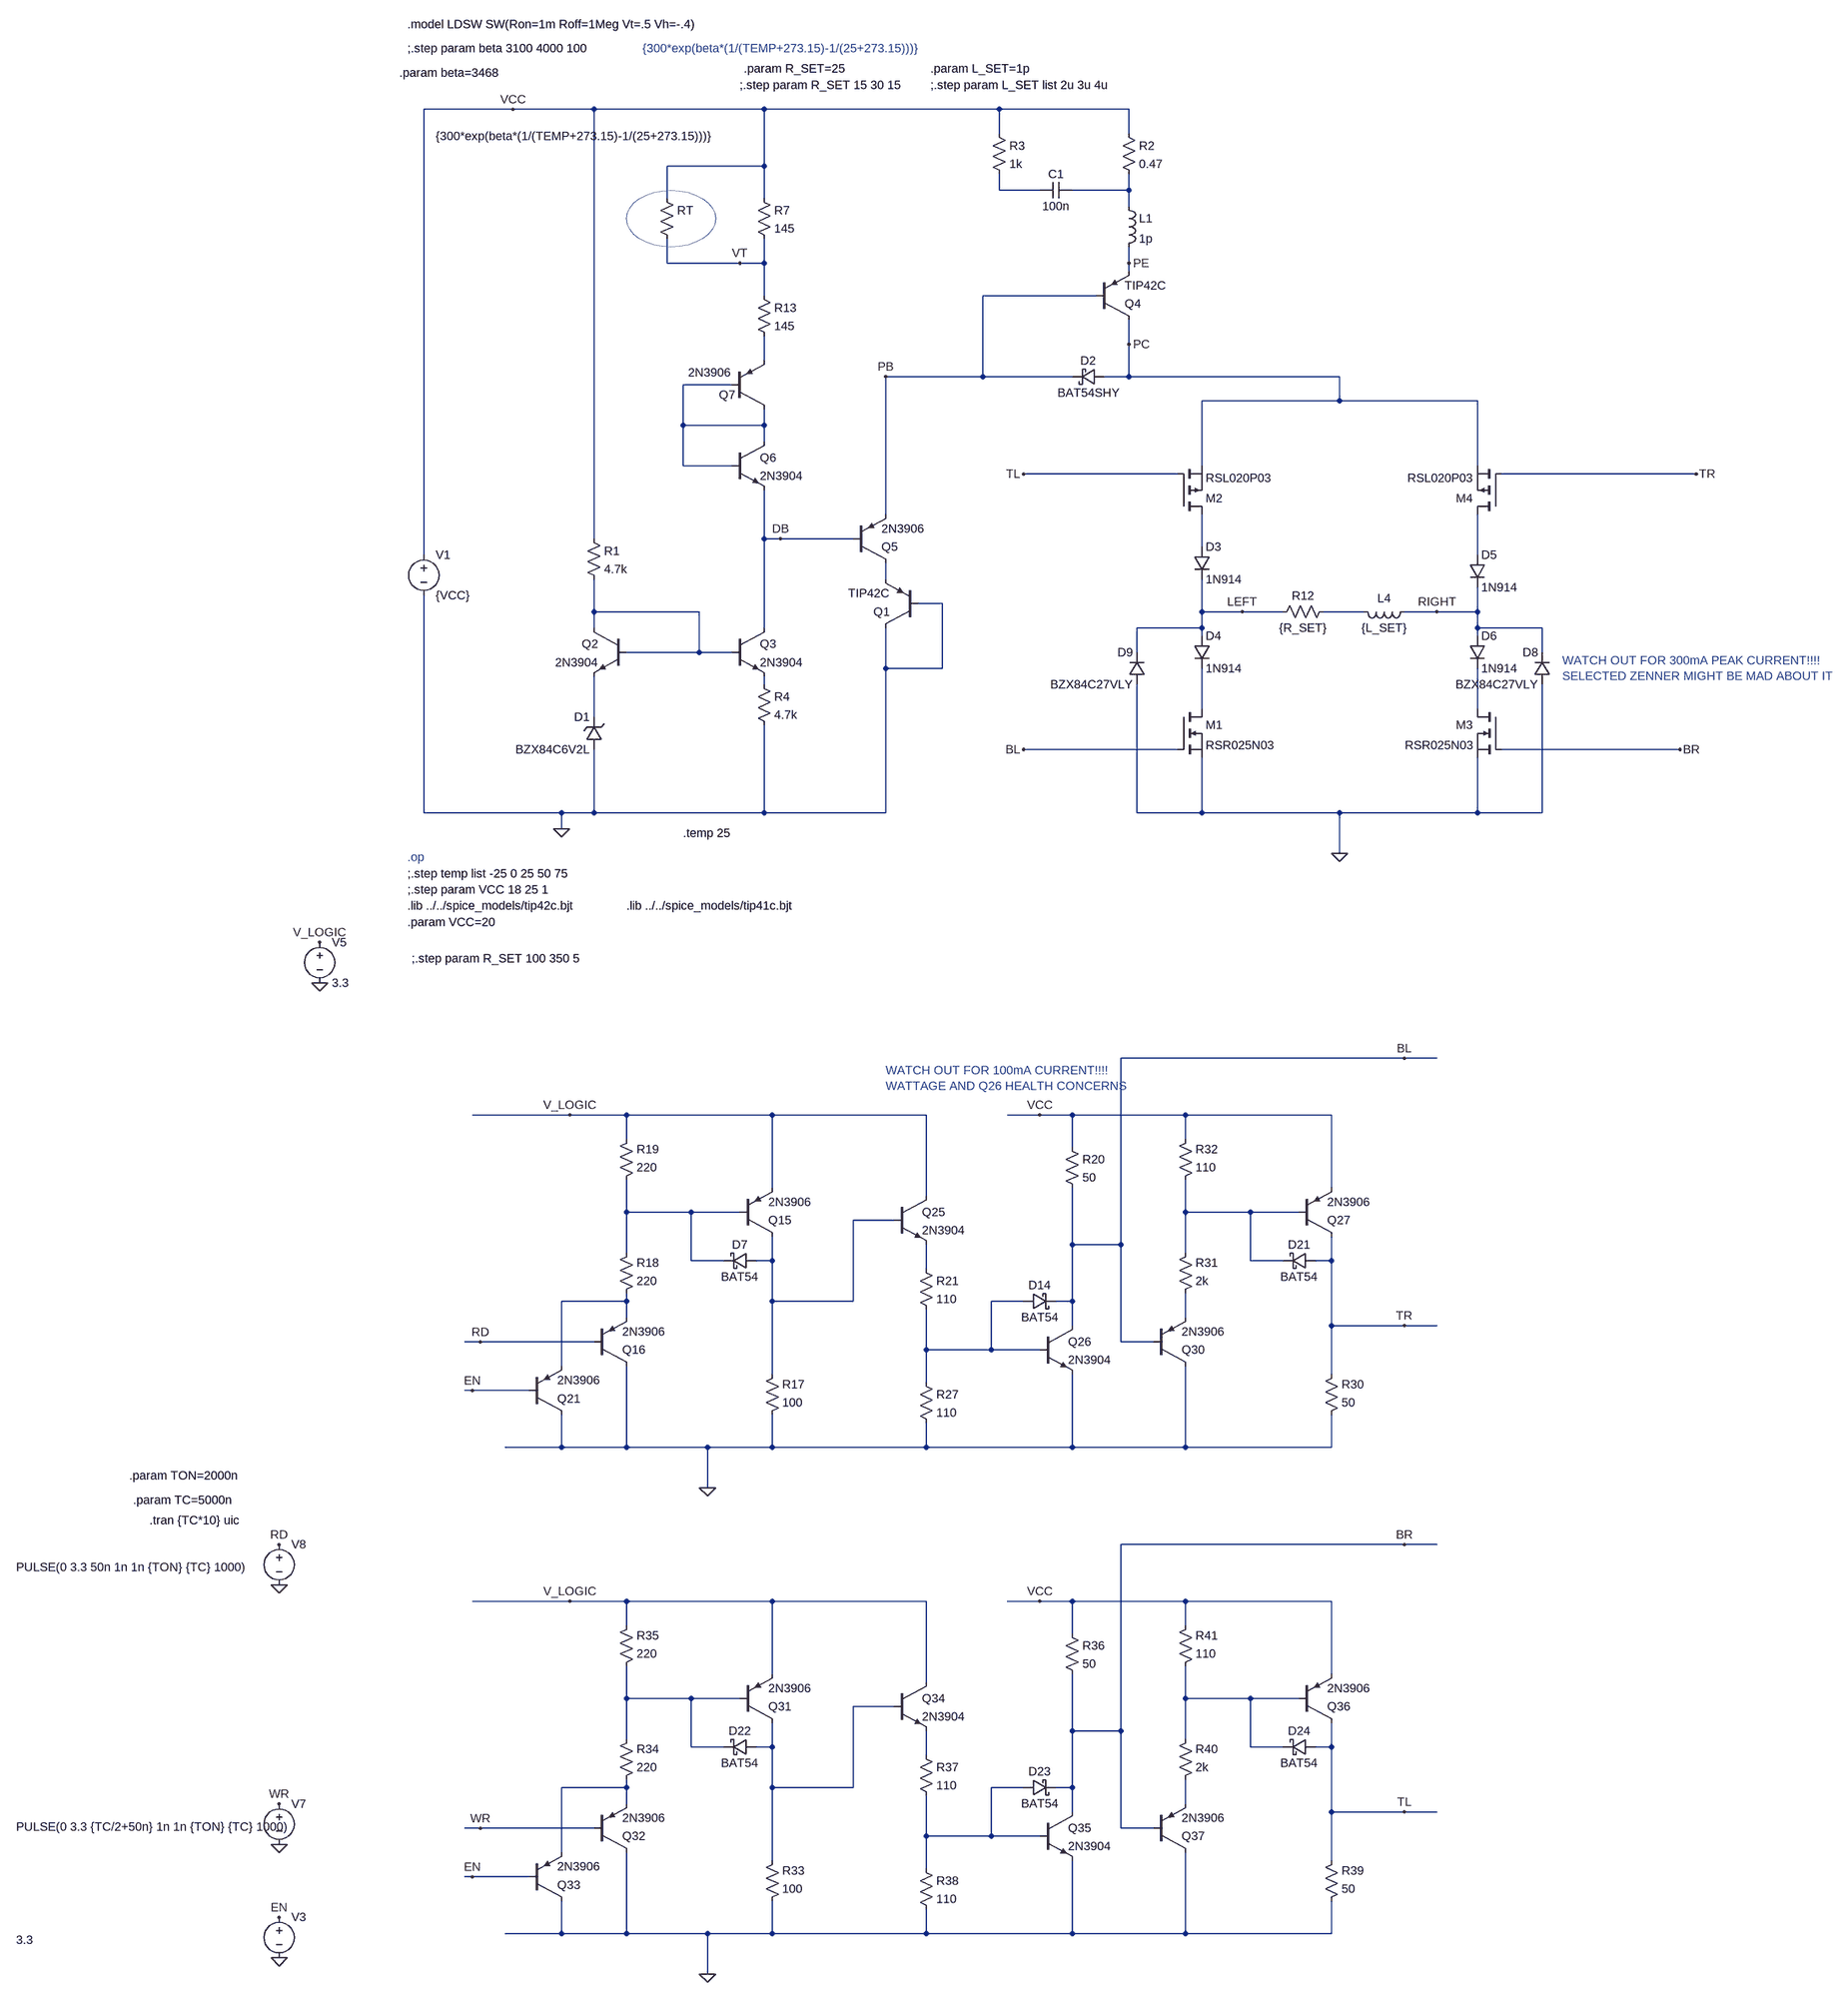
[diagram p0: schematic line_switch_mos.asc]
line_switch_mos.asc, the LTspice schematic file:
Version 4
SHEET 1 4220 5156
WIRE -2416 -1376 -2592 -1376
WIRE -2256 -1376 -2416 -1376
WIRE -1920 -1376 -2256 -1376
WIRE -1456 -1376 -1920 -1376
WIRE -1200 -1376 -1456 -1376
WIRE -1456 -1328 -1456 -1376
WIRE -1200 -1328 -1200 -1376
WIRE -1920 -1264 -1920 -1376
WIRE -1920 -1264 -2112 -1264
WIRE -1456 -1216 -1456 -1248
WIRE -1376 -1216 -1456 -1216
WIRE -1200 -1216 -1200 -1248
WIRE -1200 -1216 -1312 -1216
WIRE -2112 -1200 -2112 -1264
WIRE -1920 -1200 -1920 -1264
WIRE -1200 -1184 -1200 -1216
WIRE -2112 -1072 -2112 -1120
WIRE -1968 -1072 -2112 -1072
WIRE -1920 -1072 -1920 -1120
WIRE -1920 -1072 -1968 -1072
WIRE -1200 -1072 -1200 -1104
WIRE -1200 -1056 -1200 -1072
WIRE -1920 -1008 -1920 -1072
WIRE -1264 -1008 -1488 -1008
WIRE -1200 -912 -1200 -960
WIRE -1920 -880 -1920 -928
WIRE -1488 -848 -1488 -1008
WIRE -1488 -848 -1680 -848
WIRE -1312 -848 -1488 -848
WIRE -1200 -848 -1200 -912
WIRE -1200 -848 -1248 -848
WIRE -784 -848 -1200 -848
WIRE -1984 -832 -2080 -832
WIRE -784 -800 -784 -848
WIRE -784 -800 -1056 -800
WIRE -512 -800 -784 -800
WIRE -2080 -752 -2080 -832
WIRE -1920 -752 -1920 -784
WIRE -1920 -752 -2080 -752
WIRE -1920 -720 -1920 -752
WIRE -2080 -672 -2080 -752
WIRE -1984 -672 -2080 -672
WIRE -1056 -672 -1056 -800
WIRE -512 -672 -512 -800
WIRE -1104 -656 -1408 -656
WIRE -80 -656 -464 -656
WIRE -1680 -576 -1680 -848
WIRE -2256 -528 -2256 -1376
WIRE -1920 -528 -1920 -624
WIRE -1888 -528 -1920 -528
WIRE -1744 -528 -1888 -528
WIRE -1056 -512 -1056 -576
WIRE -2592 -496 -2592 -1376
WIRE -512 -496 -512 -576
WIRE -1680 -448 -1680 -480
WIRE -1568 -400 -1616 -400
WIRE -2256 -384 -2256 -448
WIRE -2048 -384 -2256 -384
WIRE -1056 -384 -1056 -448
WIRE -976 -384 -1056 -384
WIRE -896 -384 -976 -384
WIRE -736 -384 -816 -384
WIRE -592 -384 -656 -384
WIRE -512 -384 -512 -432
WIRE -512 -384 -592 -384
WIRE -2256 -352 -2256 -384
WIRE -1920 -352 -1920 -528
WIRE -1056 -352 -1056 -384
WIRE -1056 -352 -1184 -352
WIRE -512 -352 -512 -384
WIRE -384 -352 -512 -352
WIRE -1056 -336 -1056 -352
WIRE -512 -336 -512 -352
WIRE -2048 -304 -2048 -384
WIRE -2048 -304 -2192 -304
WIRE -1984 -304 -2048 -304
WIRE -1184 -304 -1184 -352
WIRE -384 -304 -384 -352
WIRE -1680 -272 -1680 -352
WIRE -1568 -272 -1568 -400
WIRE -1568 -272 -1680 -272
WIRE -1920 -240 -1920 -256
WIRE -1056 -192 -1056 -272
WIRE -512 -192 -512 -272
WIRE -2256 -176 -2256 -256
WIRE -1104 -112 -1408 -112
WIRE -112 -112 -464 -112
WIRE -2592 16 -2592 -416
WIRE -2320 16 -2592 16
WIRE -2256 16 -2256 -112
WIRE -2256 16 -2320 16
WIRE -1920 16 -1920 -160
WIRE -1920 16 -2256 16
WIRE -1680 16 -1680 -272
WIRE -1680 16 -1920 16
WIRE -1184 16 -1184 -240
WIRE -1056 16 -1056 -96
WIRE -1056 16 -1184 16
WIRE -784 16 -1056 16
WIRE -512 16 -512 -96
WIRE -512 16 -784 16
WIRE -384 16 -384 -240
WIRE -384 16 -512 16
WIRE -2320 48 -2320 16
WIRE -784 96 -784 16
WIRE -656 544 -1216 544
WIRE -592 544 -656 544
WIRE -2304 656 -2496 656
WIRE -2192 656 -2304 656
WIRE -1904 656 -2192 656
WIRE -1600 656 -1904 656
WIRE -1376 656 -1440 656
WIRE -1312 656 -1376 656
WIRE -1088 656 -1312 656
WIRE -800 656 -1088 656
WIRE -2192 704 -2192 656
WIRE -1088 704 -1088 656
WIRE -1312 720 -1312 656
WIRE -1904 800 -1904 656
WIRE -800 800 -800 656
WIRE -1600 816 -1600 656
WIRE -2192 848 -2192 784
WIRE -2064 848 -2192 848
WIRE -1968 848 -2064 848
WIRE -1088 848 -1088 784
WIRE -960 848 -1088 848
WIRE -864 848 -960 848
WIRE -1664 864 -1744 864
WIRE -1312 912 -1312 800
WIRE -1216 912 -1216 544
WIRE -1216 912 -1312 912
WIRE -2192 928 -2192 848
WIRE -1088 928 -1088 848
WIRE -2064 944 -2064 848
WIRE -2000 944 -2064 944
WIRE -1904 944 -1904 896
WIRE -1904 944 -1936 944
WIRE -960 944 -960 848
WIRE -896 944 -960 944
WIRE -800 944 -800 896
WIRE -800 944 -832 944
WIRE -1600 960 -1600 912
WIRE -2192 1024 -2192 1008
WIRE -2192 1024 -2320 1024
WIRE -1904 1024 -1904 944
WIRE -1744 1024 -1744 864
WIRE -1744 1024 -1904 1024
WIRE -1408 1024 -1472 1024
WIRE -1312 1024 -1312 912
WIRE -1312 1024 -1344 1024
WIRE -2192 1056 -2192 1024
WIRE -1088 1056 -1088 1008
WIRE -1312 1072 -1312 1024
WIRE -800 1072 -800 944
WIRE -656 1072 -800 1072
WIRE -592 1072 -656 1072
WIRE -2480 1104 -2512 1104
WIRE -2256 1104 -2480 1104
WIRE -1216 1104 -1216 912
WIRE -1152 1104 -1216 1104
WIRE -1600 1120 -1600 1040
WIRE -1472 1120 -1472 1024
WIRE -1472 1120 -1600 1120
WIRE -1376 1120 -1472 1120
WIRE -2320 1152 -2320 1024
WIRE -1904 1168 -1904 1024
WIRE -800 1168 -800 1072
WIRE -1600 1184 -1600 1120
WIRE -2496 1200 -2512 1200
WIRE -2384 1200 -2496 1200
WIRE -2320 1312 -2320 1248
WIRE -2320 1312 -2432 1312
WIRE -2192 1312 -2192 1152
WIRE -2192 1312 -2320 1312
WIRE -2032 1312 -2192 1312
WIRE -1904 1312 -1904 1248
WIRE -1904 1312 -2032 1312
WIRE -1600 1312 -1600 1264
WIRE -1600 1312 -1904 1312
WIRE -1312 1312 -1312 1168
WIRE -1312 1312 -1600 1312
WIRE -1088 1312 -1088 1152
WIRE -1088 1312 -1312 1312
WIRE -800 1312 -800 1248
WIRE -800 1312 -1088 1312
WIRE -2032 1392 -2032 1312
WIRE -656 1504 -1216 1504
WIRE -592 1504 -656 1504
WIRE -2304 1616 -2496 1616
WIRE -2192 1616 -2304 1616
WIRE -1904 1616 -2192 1616
WIRE -1600 1616 -1904 1616
WIRE -1376 1616 -1440 1616
WIRE -1312 1616 -1376 1616
WIRE -1088 1616 -1312 1616
WIRE -800 1616 -1088 1616
WIRE -2192 1664 -2192 1616
WIRE -1088 1664 -1088 1616
WIRE -1312 1680 -1312 1616
WIRE -1904 1760 -1904 1616
WIRE -800 1760 -800 1616
WIRE -1600 1776 -1600 1616
WIRE -2192 1808 -2192 1744
WIRE -2064 1808 -2192 1808
WIRE -1968 1808 -2064 1808
WIRE -1088 1808 -1088 1744
WIRE -960 1808 -1088 1808
WIRE -864 1808 -960 1808
WIRE -1664 1824 -1744 1824
WIRE -1312 1872 -1312 1760
WIRE -1216 1872 -1216 1504
WIRE -1216 1872 -1312 1872
WIRE -2192 1888 -2192 1808
WIRE -1088 1888 -1088 1808
WIRE -2064 1904 -2064 1808
WIRE -2000 1904 -2064 1904
WIRE -1904 1904 -1904 1856
WIRE -1904 1904 -1936 1904
WIRE -960 1904 -960 1808
WIRE -896 1904 -960 1904
WIRE -800 1904 -800 1856
WIRE -800 1904 -832 1904
WIRE -1600 1920 -1600 1872
WIRE -2192 1984 -2192 1968
WIRE -2192 1984 -2320 1984
WIRE -1904 1984 -1904 1904
WIRE -1744 1984 -1744 1824
WIRE -1744 1984 -1904 1984
WIRE -1408 1984 -1472 1984
WIRE -1312 1984 -1312 1872
WIRE -1312 1984 -1344 1984
WIRE -2192 2016 -2192 1984
WIRE -1088 2016 -1088 1968
WIRE -1312 2032 -1312 1984
WIRE -800 2032 -800 1904
WIRE -656 2032 -800 2032
WIRE -592 2032 -656 2032
WIRE -2480 2064 -2512 2064
WIRE -2256 2064 -2480 2064
WIRE -1216 2064 -1216 1872
WIRE -1152 2064 -1216 2064
WIRE -1600 2080 -1600 2000
WIRE -1472 2080 -1472 1984
WIRE -1472 2080 -1600 2080
WIRE -1376 2080 -1472 2080
WIRE -2320 2112 -2320 1984
WIRE -1904 2128 -1904 1984
WIRE -800 2128 -800 2032
WIRE -1600 2144 -1600 2080
WIRE -2496 2160 -2512 2160
WIRE -2384 2160 -2496 2160
WIRE -2320 2272 -2320 2208
WIRE -2320 2272 -2432 2272
WIRE -2192 2272 -2192 2112
WIRE -2192 2272 -2320 2272
WIRE -2032 2272 -2192 2272
WIRE -1904 2272 -1904 2208
WIRE -1904 2272 -2032 2272
WIRE -1600 2272 -1600 2224
WIRE -1600 2272 -1904 2272
WIRE -1312 2272 -1312 2128
WIRE -1312 2272 -1600 2272
WIRE -1088 2272 -1088 2112
WIRE -1088 2272 -1312 2272
WIRE -800 2272 -800 2208
WIRE -800 2272 -1088 2272
WIRE -2032 2352 -2032 2272
FLAG -2320 48 0
FLAG -1200 -1072 PE
FLAG -1200 -912 PC
FLAG -1968 -1072 VT
FLAG -2416 -1376 VCC
FLAG -1680 -848 PB
FLAG -1888 -528 DB
FLAG -784 96 0
FLAG -2976 352 0
FLAG -2976 272 V_LOGIC
FLAG -3056 2016 WR
FLAG -3056 2096 0
FLAG -3056 1504 RD
FLAG -3056 1584 0
FLAG -3056 2240 EN
FLAG -3056 2320 0
FLAG -2480 1104 RD
FLAG -2304 656 V_LOGIC
FLAG -2496 1200 EN
FLAG -1376 656 VCC
FLAG -2032 1392 0
FLAG -656 544 BL
FLAG -656 1072 TR
FLAG -2480 2064 WR
FLAG -2304 1616 V_LOGIC
FLAG -2496 2160 EN
FLAG -1376 1616 VCC
FLAG -2032 2352 0
FLAG -656 1504 BR
FLAG -656 2032 TL
FLAG -1408 -656 TL
FLAG -1408 -112 BL
FLAG -80 -656 TR
FLAG -112 -112 BR
FLAG -976 -384 LEFT
FLAG -592 -384 RIGHT
SYMBOL npn -2192 -352 M0
SYMATTR InstName Q2
SYMATTR Value 2N3904
SYMBOL zener -2240 -112 R180
WINDOW 0 24 64 Left 2
WINDOW 3 24 0 Left 2
SYMATTR InstName D1
SYMATTR Value BZX84C6V2L
SYMBOL res -2272 -544 R0
SYMATTR InstName R1
SYMATTR Value 4.7k
SYMBOL res -1216 -1344 R0
SYMATTR InstName R2
SYMATTR Value 0.47
SYMBOL voltage -2592 -512 R0
SYMATTR InstName V1
SYMATTR Value {VCC}
SYMBOL npn -1984 -352 R0
SYMATTR InstName Q3
SYMATTR Value 2N3904
SYMBOL res -1936 -256 R0
SYMATTR InstName R4
SYMATTR Value 4.7k
SYMBOL pnp -1264 -960 M180
SYMATTR InstName Q4
SYMATTR Value TIP42C
SYMBOL pnp -1744 -480 M180
SYMATTR InstName Q5
SYMATTR Value 2N3906
SYMBOL pnp -1984 -784 M180
WINDOW 0 -25 28 Left 2
WINDOW 3 -86 72 Left 2
SYMATTR InstName Q7
SYMATTR Value 2N3906
SYMBOL npn -1984 -720 R0
SYMATTR InstName Q6
SYMATTR Value 2N3904
SYMBOL res -1936 -1216 R0
SYMATTR InstName R7
SYMATTR Value 145
SYMBOL res -1936 -1024 R0
SYMATTR InstName R13
SYMATTR Value 145
SYMBOL res -2128 -1216 R0
WINDOW 3 -440 -107 Left 2
SYMATTR Value {300*exp(beta*(1/(TEMP+273.15)-1/(25+273.15)))}
SYMATTR InstName RT
SYMBOL pnp -1616 -352 R180
SYMATTR InstName Q1
SYMATTR Value TIP42C
SYMBOL schottky -1248 -864 R90
WINDOW 0 0 32 VBottom 2
WINDOW 3 32 32 VTop 2
SYMATTR InstName D2
SYMATTR Value BAT54SHY
SYMATTR Description Diode
SYMATTR Type diode
SYMBOL res -800 -400 R90
WINDOW 0 0 56 VBottom 2
WINDOW 3 32 56 VTop 2
SYMATTR InstName R12
SYMATTR Value {R_SET}
SYMBOL ind -640 -400 R90
WINDOW 0 5 56 VBottom 2
WINDOW 3 32 56 VTop 2
SYMATTR InstName L4
SYMATTR Value {L_SET}
SYMBOL voltage -2976 256 R0
SYMATTR InstName V5
SYMATTR Value 3.3
SYMBOL voltage -3056 2000 R0
WINDOW 123 0 0 Left 0
WINDOW 39 0 0 Left 0
WINDOW 3 -519 61 Left 2
SYMATTR Value PULSE(0 3.3 {TC/2+50n} 1n 1n {TON} {TC} 1000)
SYMATTR InstName V7
SYMBOL voltage -3056 1488 R0
WINDOW 123 0 0 Left 0
WINDOW 39 0 0 Left 0
WINDOW 3 -519 61 Left 2
SYMATTR Value PULSE(0 3.3 50n 1n 1n {TON} {TC} 1000)
SYMATTR InstName V8
SYMBOL voltage -3056 2224 R0
WINDOW 123 0 0 Left 0
WINDOW 39 0 0 Left 0
WINDOW 3 -519 61 Left 2
SYMATTR Value 3.3
SYMATTR InstName V3
SYMBOL schottky -1936 960 M270
WINDOW 0 32 32 VTop 2
WINDOW 3 0 32 VBottom 2
SYMATTR InstName D7
SYMATTR Value BAT54
SYMATTR Description Diode
SYMATTR Type diode
SYMBOL res -1920 1264 M180
WINDOW 0 36 76 Left 2
WINDOW 3 36 40 Left 2
SYMATTR InstName R17
SYMATTR Value 100
SYMBOL res -2208 1024 M180
WINDOW 0 36 76 Left 2
WINDOW 3 36 40 Left 2
SYMATTR InstName R18
SYMATTR Value 220
SYMBOL res -2208 800 M180
WINDOW 0 36 76 Left 2
WINDOW 3 36 40 Left 2
SYMATTR InstName R19
SYMATTR Value 220
SYMBOL pnp -1968 896 M180
SYMATTR InstName Q15
SYMATTR Value 2N3906
SYMBOL pnp -2256 1152 M180
SYMATTR InstName Q16
SYMATTR Value 2N3906
SYMBOL pnp -2384 1248 M180
SYMATTR InstName Q21
SYMATTR Value 2N3906
SYMBOL schottky -1408 1008 M90
WINDOW 0 0 32 VBottom 2
WINDOW 3 32 32 VTop 2
SYMATTR InstName D14
SYMATTR Value BAT54
SYMATTR Description Diode
SYMATTR Type diode
SYMBOL res -1328 704 R0
SYMATTR InstName R20
SYMATTR Value 50
SYMBOL res -1616 944 R0
SYMATTR InstName R21
SYMATTR Value 110
SYMBOL res -1616 1168 R0
SYMATTR InstName R27
SYMATTR Value 110
SYMBOL npn -1664 816 R0
SYMATTR InstName Q25
SYMATTR Value 2N3904
SYMBOL npn -1376 1072 R0
SYMATTR InstName Q26
SYMATTR Value 2N3904
SYMBOL schottky -832 960 M270
WINDOW 0 32 32 VTop 2
WINDOW 3 0 32 VBottom 2
SYMATTR InstName D21
SYMATTR Value BAT54
SYMATTR Description Diode
SYMATTR Type diode
SYMBOL res -816 1264 M180
WINDOW 0 36 76 Left 2
WINDOW 3 36 40 Left 2
SYMATTR InstName R30
SYMATTR Value 50
SYMBOL res -1104 1024 M180
WINDOW 0 36 76 Left 2
WINDOW 3 36 40 Left 2
SYMATTR InstName R31
SYMATTR Value 2k
SYMBOL res -1104 800 M180
WINDOW 0 36 76 Left 2
WINDOW 3 36 40 Left 2
SYMATTR InstName R32
SYMATTR Value 110
SYMBOL pnp -864 896 M180
SYMATTR InstName Q27
SYMATTR Value 2N3906
SYMBOL pnp -1152 1152 M180
SYMATTR InstName Q30
SYMATTR Value 2N3906
SYMBOL schottky -1936 1920 M270
WINDOW 0 32 32 VTop 2
WINDOW 3 0 32 VBottom 2
SYMATTR InstName D22
SYMATTR Value BAT54
SYMATTR Description Diode
SYMATTR Type diode
SYMBOL res -1920 2224 M180
WINDOW 0 36 76 Left 2
WINDOW 3 36 40 Left 2
SYMATTR InstName R33
SYMATTR Value 100
SYMBOL res -2208 1984 M180
WINDOW 0 36 76 Left 2
WINDOW 3 36 40 Left 2
SYMATTR InstName R34
SYMATTR Value 220
SYMBOL res -2208 1760 M180
WINDOW 0 36 76 Left 2
WINDOW 3 36 40 Left 2
SYMATTR InstName R35
SYMATTR Value 220
SYMBOL pnp -1968 1856 M180
SYMATTR InstName Q31
SYMATTR Value 2N3906
SYMBOL pnp -2256 2112 M180
SYMATTR InstName Q32
SYMATTR Value 2N3906
SYMBOL pnp -2384 2208 M180
SYMATTR InstName Q33
SYMATTR Value 2N3906
SYMBOL schottky -1408 1968 M90
WINDOW 0 0 32 VBottom 2
WINDOW 3 32 32 VTop 2
SYMATTR InstName D23
SYMATTR Value BAT54
SYMATTR Description Diode
SYMATTR Type diode
SYMBOL res -1328 1664 R0
SYMATTR InstName R36
SYMATTR Value 50
SYMBOL res -1616 1904 R0
SYMATTR InstName R37
SYMATTR Value 110
SYMBOL res -1616 2128 R0
SYMATTR InstName R38
SYMATTR Value 110
SYMBOL npn -1664 1776 R0
SYMATTR InstName Q34
SYMATTR Value 2N3904
SYMBOL npn -1376 2032 R0
SYMATTR InstName Q35
SYMATTR Value 2N3904
SYMBOL schottky -832 1920 M270
WINDOW 0 32 32 VTop 2
WINDOW 3 0 32 VBottom 2
SYMATTR InstName D24
SYMATTR Value BAT54
SYMATTR Description Diode
SYMATTR Type diode
SYMBOL res -816 2224 M180
WINDOW 0 36 76 Left 2
WINDOW 3 36 40 Left 2
SYMATTR InstName R39
SYMATTR Value 50
SYMBOL res -1104 1984 M180
WINDOW 0 36 76 Left 2
WINDOW 3 36 40 Left 2
SYMATTR InstName R40
SYMATTR Value 2k
SYMBOL res -1104 1760 M180
WINDOW 0 36 76 Left 2
WINDOW 3 36 40 Left 2
SYMATTR InstName R41
SYMATTR Value 110
SYMBOL pnp -864 1856 M180
SYMATTR InstName Q36
SYMATTR Value 2N3906
SYMBOL pnp -1152 2112 M180
SYMATTR InstName Q37
SYMATTR Value 2N3906
SYMBOL nmos -1104 -192 R0
SYMATTR InstName M1
SYMATTR Value RSR025N03
SYMBOL pmos -1104 -576 M180
SYMATTR InstName M2
SYMATTR Value RSL020P03
SYMBOL nmos -464 -192 M0
SYMATTR InstName M3
SYMATTR Value RSR025N03
SYMBOL pmos -464 -576 R180
SYMATTR InstName M4
SYMATTR Value RSL020P03
SYMBOL cap -1312 -1232 R90
WINDOW 0 0 32 VBottom 2
WINDOW 3 32 32 VTop 2
SYMATTR InstName C1
SYMATTR Value 100n
SYMBOL diode -1072 -512 R0
SYMATTR InstName D3
SYMATTR Value 1N914
SYMBOL diode -1072 -336 R0
SYMATTR InstName D4
SYMATTR Value 1N914
SYMBOL diode -528 -496 R0
SYMATTR InstName D5
SYMATTR Value 1N914
SYMBOL diode -528 -336 R0
SYMATTR InstName D6
SYMATTR Value 1N914
SYMBOL diode -368 -240 R180
WINDOW 0 24 64 Left 2
WINDOW 3 24 0 Left 2
SYMATTR InstName D8
SYMATTR Value BZX84C27VLY
SYMBOL diode -1168 -240 R180
WINDOW 0 24 64 Left 2
WINDOW 3 24 0 Left 2
SYMATTR InstName D9
SYMATTR Value BZX84C27VLY
SYMBOL ind -1216 -1200 R0
SYMATTR InstName L1
SYMATTR Value 1p
SYMBOL res -1472 -1344 R0
SYMATTR InstName R3
SYMATTR Value 1k
TEXT -3312 1456 Left 2 !.tran {TC*10} uic
TEXT -2624 136 Left 2 !;.step temp list -25 0 25 50 75
TEXT -2624 104 Left 2 ;.op
TEXT -2624 168 Left 2 !;.step param VCC 18 25 1
TEXT -2624 200 Left 2 !.lib ../../spice_models/tip42c.bjt
TEXT -2624 232 Left 2 !.param VCC=20
TEXT -2616 304 Left 2 !;.step param R_SET 100 350 5
TEXT -2640 -1448 Left 2 !.param beta=3468
TEXT -2624 -1496 Left 2 !;.step param beta 3100 4000 100
TEXT -2160 -1496 Left 2 ;{300*exp(beta*(1/(TEMP+273.15)-1/(25+273.15)))}
TEXT -1968 -1424 Left 2 !;.step param R_SET 15 30 15
TEXT -2624 -1544 Left 2 !.model LDSW SW(Ron=1m Roff=1Meg Vt=.5 Vh=-.4)
TEXT -2080 56 Left 2 !.temp 25
TEXT -1592 -1424 Left 2 !;.step param L_SET list 2u 3u 4u
TEXT -2192 200 Left 2 !.lib ../../spice_models/tip41c.bjt
TEXT -1592 -1456 Left 2 !.param L_SET=1p
TEXT -1960 -1456 Left 2 !.param R_SET=25
TEXT -3352 1368 Left 2 !.param TON=2000n
TEXT -3344 1416 Left 2 !.param TC=5000n
TEXT -344 -288 Left 2 ;WATCH OUT FOR 300mA PEAK CURRENT!!!!\nSELECTED ZENNER MIGHT BE MAD ABOUT IT
TEXT -1680 568 Left 2 ;WATCH OUT FOR 100mA CURRENT!!!!\nWATTAGE AND Q26 HEALTH CONCERNS
CIRCLE Normal -2016 -1104 -2192 -1216 2

The netlist it stands for:
* line_switch_mos.asc
Q2 N008 N008 N013 0 2N3904
D1 0 N013 BZX84C6V2L
R1 VCC N008 4.7k
R2 VCC N002 0.47
V1 VCC 0 {VCC}
Q3 DB N008 N010 0 2N3904
R4 N010 0 4.7k
Q4 PC PB PE 0 TIP42C
Q5 N007 DB PB 0 2N3906
Q7 N004 N004 N003 0 2N3906
Q6 N004 N004 DB 0 2N3904
R7 VCC VT 145
R13 VT N003 145
RT VCC VT {300*exp(beta*(1/(TEMP+273.15)-1/(25+273.15)))}
Q1 0 0 N007 0 TIP42C
D2 PC PB BAT54SHY
R12 N009 LEFT {R_SET}
L4 RIGHT N009 {L_SET}
V5 V_LOGIC 0 3.3
V7 WR 0 PULSE(0 3.3 {TC/2+50n} 1n 1n {TON} {TC} 1000)
V8 RD 0 PULSE(0 3.3 50n 1n 1n {TON} {TC} 1000)
V3 EN 0 3.3
D7 N016 N014 BAT54
R17 0 N016 100
R18 N018 N014 220
R19 N014 V_LOGIC 220
Q15 N016 N014 V_LOGIC 0 2N3906
Q16 0 RD N018 0 2N3906
Q21 0 EN N018 0 2N3906
D14 N019 BL BAT54
R20 VCC BL 50
R21 N017 N019 110
R27 N019 0 110
Q25 V_LOGIC N016 N017 0 2N3904
Q26 BL N019 0 0 2N3904
D21 TR N015 BAT54
R30 0 TR 50
R31 N020 N015 2k
R32 N015 VCC 110
Q27 TR N015 VCC 0 2N3906
Q30 0 BL N020 0 2N3906
D22 N023 N021 BAT54
R33 0 N023 100
R34 N025 N021 220
R35 N021 V_LOGIC 220
Q31 N023 N021 V_LOGIC 0 2N3906
Q32 0 WR N025 0 2N3906
Q33 0 EN N025 0 2N3906
D23 N026 BR BAT54
R36 VCC BR 50
R37 N024 N026 110
R38 N026 0 110
Q34 V_LOGIC N023 N024 0 2N3904
Q35 BR N026 0 0 2N3904
D24 TL N022 BAT54
R39 0 TL 50
R40 N027 N022 2k
R41 N022 VCC 110
Q36 TL N022 VCC 0 2N3906
Q37 0 BR N027 0 2N3906
M1 N011 BL 0 0 RSR025N03
M2 N005 TL PC PC RSL020P03
M3 N012 BR 0 0 RSR025N03
M4 N006 TR PC PC RSL020P03
C1 N002 N001 100n
D3 N005 LEFT 1N914
D4 LEFT N011 1N914
D5 N006 RIGHT 1N914
D6 RIGHT N012 1N914
D8 0 RIGHT BZX84C27VLY
D9 0 LEFT BZX84C27VLY
L1 N002 PE 1p
R3 VCC N001 1k
.model D D
.lib standard.dio
.model NPN NPN
.model PNP PNP
.lib standard.bjt
.model NMOS NMOS
.model PMOS PMOS
.lib standard.mos
.tran {TC*10} uic
;.step temp list -25 0 25 50 75
* .op
;.step param VCC 18 25 1
.lib ../../spice_models/tip42c.bjt
.param VCC=20
;.step param R_SET 100 350 5
.param beta=3468
;.step param beta 3100 4000 100
* {300*exp(beta*(1/(TEMP+273.15)-1/(25+273.15)))}
;.step param R_SET 15 30 15
.model LDSW SW(Ron=1m Roff=1Meg Vt=.5 Vh=-.4)
.temp 25
;.step param L_SET list 2u 3u 4u
.lib ../../spice_models/tip41c.bjt
.param L_SET=1p
.param R_SET=25
.param TON=2000n
.param TC=5000n
* WATCH OUT FOR 300mA PEAK CURRENT!!!!
* SELECTED ZENNER MIGHT BE MAD ABOUT IT
* WATCH OUT FOR 100mA CURRENT!!!!
* WATTAGE AND Q26 HEALTH CONCERNS
.backanno
.end